# Altium schematic sheet Step-Up Converter.SchDoc
size A
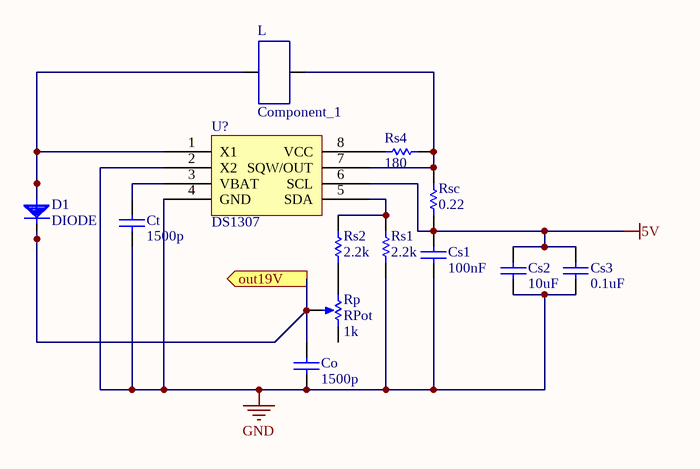
[diagram p0: Step-Up Converter.SchDoc]

## Parts
Co  value 1500p  [CC2012-0805]  (hidden comment: Cap-NP)
Cs1  value 100nF  [CC2012-0805]  (hidden comment: Cap-NP)
Cs2  value 10uF  [CC2012-0805]  (hidden comment: Cap-NP)
Cs3  value 0.1uF  [CC2012-0805]  (hidden comment: Cap-NP)
Ct  value 1500p  [CC2012-0805]  (hidden comment: Cap-NP)
D1  DIODE  [D1N40XX]
L  Component_1  [PCBComponent_1]
Rp  RPot  value 1k  [VR_MUL-V]
Rs1  value 2.2k  [CC2012-0805]  (hidden comment: Res)
Rs2  value 2.2k  [CC2012-0805]  (hidden comment: Res)
Rs4  value 180  [CC2012-0805]  (hidden comment: Res)
Rsc  value 0.22  [CC2012-0805]  (hidden comment: Res)
U?  DS1307  [DIP8L]

## Ports
out19V (out)

## Nets
5V: Cs1.2 Cs2.1 Cs3.1 Rsc.1 U?.6(SCL)
GND: Co.1 Cs1.1 Cs2.2 Cs3.2 Ct.1 Rs1.1 U?.2(X2) U?.4(GND)
out19V: Co.2 D1.1(K) Rp.2(TAP) ; port out19V
NetCt_2: Ct.2 U?.3(VBAT)
NetD1_2: D1.2(a) L.1 U?.1(X1)
NetL_2: L.2 Rs4.2 Rsc.2 U?.7(SQW/OUT)
NetRp_1: Rp.1(TOP) Rs2.1
NetRs1_2: Rs1.2 Rs2.2 U?.5(SDA)
NetRs4_1: Rs4.1 U?.8(VCC)

Not connected (* = marked no-connect by the designer): Rp 3(BOT)

## Library data of the parts
Co Cs1-Cs3 Ct = Cap-NP: Capacitor; Manufacturer: Generic Components; Class I: Passive; Published: 8-Jun-2000; Revision: July-2002: Re-released for DXP Platform.; Publisher: Altium Limited; Class II: Capacitor
L = Component_1: power inductor
Rp = RPot: Potentiometer; Manufacturer: Generic Components; Class I: Passive; Set Position: 0.5; Published: 8-Jun-2000; Revision: July-2002: Re-released for DXP Platform.; Publisher: Altium Limited; Class II: Potentiometer
Rs1 Rs2 Rs4 Rsc = Res: Resistor; Manufacturer: Generic Components; Class I: Passive; Published: 8-Jun-2000; Revision: July-2002: Re-released for DXP Platform.; Publisher: Altium Limited; Class II: Resistor